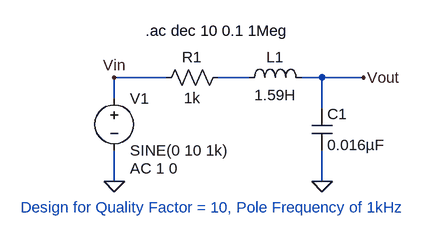
[diagram p0: schematic 2ndOrderSeriesRLCLPF.asc]
2ndOrderSeriesRLCLPF.asc, the LTspice schematic file:
Version 4
SHEET 1 880 680
WIRE 80 112 0 112
WIRE 208 112 160 112
WIRE 320 112 288 112
WIRE 384 112 320 112
WIRE 0 144 0 112
WIRE 320 160 320 112
WIRE 0 272 0 224
WIRE 320 272 320 224
FLAG 0 272 0
FLAG 320 272 0
FLAG 0 112 Vin
FLAG 384 112 Vout
SYMBOL res 176 96 R90
WINDOW 0 0 56 VBottom 2
WINDOW 3 32 56 VTop 2
SYMATTR InstName R1
SYMATTR Value 1k
SYMBOL cap 304 160 R0
SYMATTR InstName C1
SYMATTR Value 0.016µF
SYMBOL ind 192 128 R270
WINDOW 0 32 56 VTop 2
WINDOW 3 5 56 VBottom 2
SYMATTR InstName L1
SYMATTR Value 1.59H
SYMBOL voltage 0 128 R0
WINDOW 123 24 124 Left 2
WINDOW 39 0 0 Left 0
SYMATTR InstName V1
SYMATTR Value SINE(0 10 1k)
SYMATTR Value2 AC 1 0
TEXT 48 40 Left 2 !.ac dec 10 0.1 1Meg
TEXT -144 312 Left 2 ;Design for Quality Factor = 10, Pole Frequency of 1kHz

The netlist it stands for:
* 2ndOrderSeriesRLCLPF.asc
R1 N001 Vin 1k
C1 Vout 0 0.016µF
L1 N001 Vout 1.59H
V1 Vin 0 SINE(0 10 1k) AC 1 0
.ac dec 10 0.1 1Meg
* Design for Quality Factor = 10, Pole Frequency of 1kHz
.backanno
.end